# Altium schematic sheet RADG-Power-S02-V00.SchDoc: RADG Power (Filtering, Power Sequencing, USB)
size A3; DrawnBy: Jonn Dillon; DocumentNumber: 3; SheetNumber: 3; SheetTotal: 5; Version: 00; Project: QUTMS RADIO GPS; PageSetup: Record=PageOptions|CenterHorizontal=True|CenterVertical=True|PrintScale=0.97|XCorrection=1.00|YCorrection=1.00|PrintKind=0|BorderSize=5000000|LeftOffset=0|BottomOffset=0|Orientation=2|PaperLength=1000|PaperWidth=1000|Scale=100|PaperSource=7|PrintQuality=-4|MediaType=1|DitherType=10|PaperKind=A4|PrintScaleMode=1
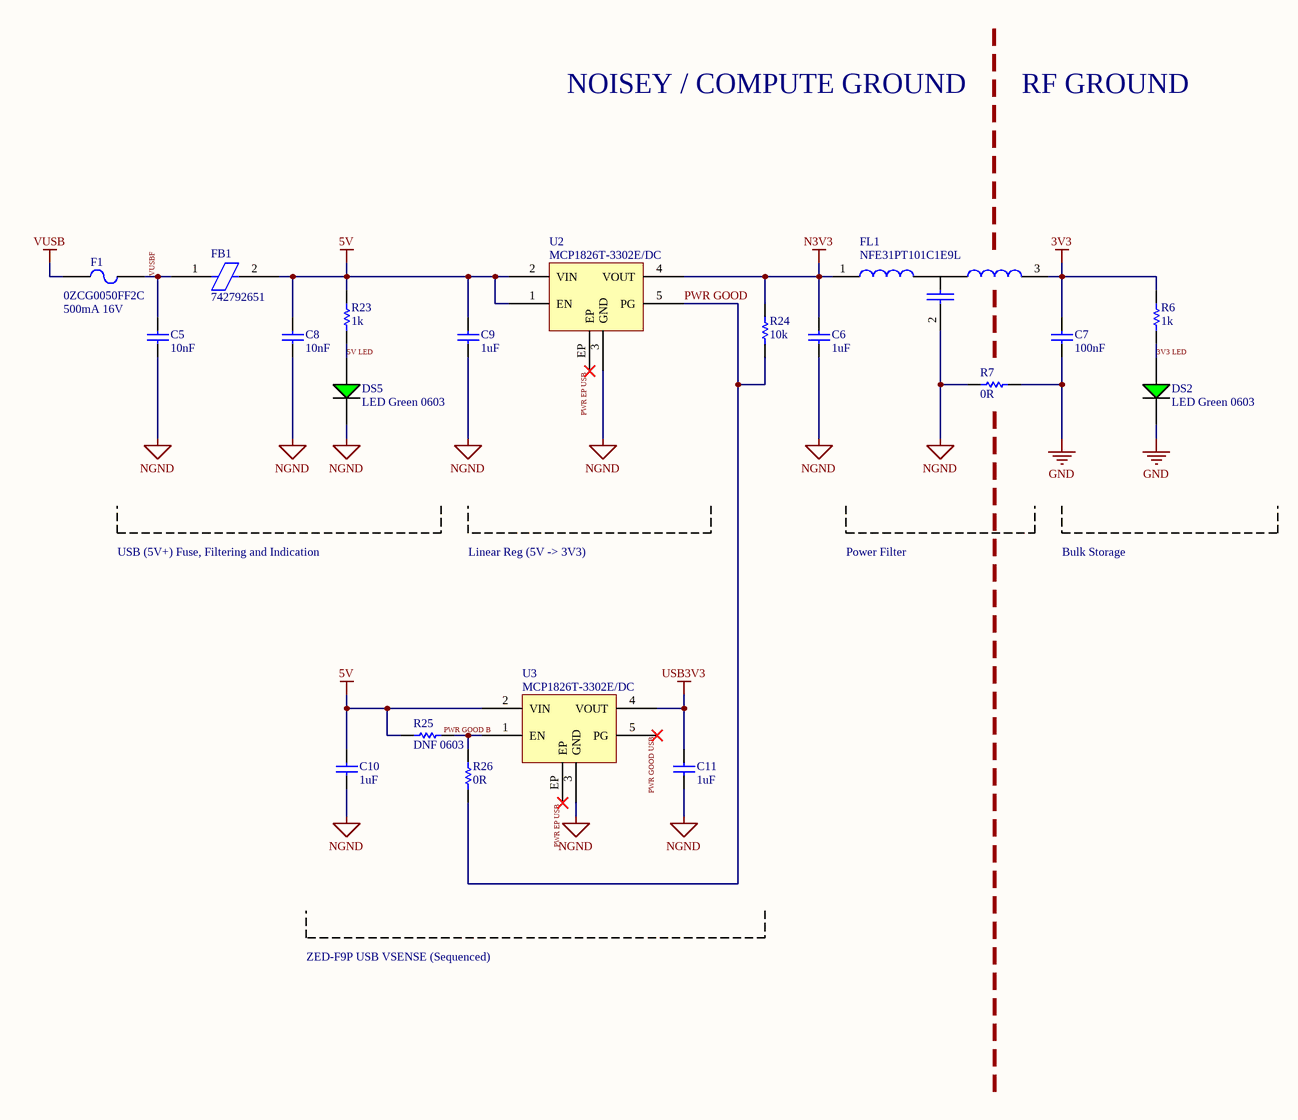
[diagram p0: RADG-Power-S02-V00.SchDoc]

## Parts
C5  10nF  [Cap_Ceramic_0603]
C6  1uF  [Cap_Ceramic_0603]
C7  100nF  [Cap_Ceramic_0603]
C8  10nF  [Cap_Ceramic_0603]
C9  1uF  [Cap_Ceramic_0603]
C10  1uF  [Cap_Ceramic_0603]
C11  1uF  [Cap_Ceramic_0603]
DS2  LED Green 0603  [LED GREEN 0603]
DS5  LED Green 0603  [LED GREEN 0603]
F1  0ZCG0050FF2C  [1812 FUSE]
FB1  742792651  [Inductor_0603]
FL1  NFE31PT101C1E9L  [NFE31PT101C1E9L]
R6  1k  [Res_ThinFilm_0603]
R7  0R  [Res_ThinFilm_0603]
R23  1k  [Res_ThinFilm_0603]
R24  10k  [Res_ThinFilm_0603]
R25  DNF 0603  [Res_ThinFilm_0603]
R26  0R  [Res_ThinFilm_0603]
U2  MCP1826T-3302E/DC  [SOT-223-5]
U3  MCP1826T-3302E/DC  [SOT-223-5]

## Nets
3V3: C7.2 FL1.3 R6.2
5V: C8.2 C9.2 C10.2 FB1.2 R23.2 R25.1 U2.1(EN) U2.2(VIN) U3.2(VIN)
GND: C7.1 DS2.2(C) R7.2
N3V3: C6.2 FL1.1 R24.2 U2.4(VOUT)
NGND: C5.1 C6.1 C8.1 C9.1 C10.1 C11.1 DS5.2(C) FL1.2 R7.1 U2.3(GND) U3.3(GND)
USB3V3: C11.2 U3.4(VOUT)
VUSB: F1.1
3V3 LED: DS2.1(A) R6.1
5V LED: DS5.1(A) R23.1
PWR EP USB: U2.EP U3.EP
PWR GOOD: R24.1 R26.1 U2.5(PG)
PWR GOOD B: R25.2 R26.2 U3.1(EN)
PWR GOOD USB: U3.5(PG)
VUSBF: C5.2 F1.2 FB1.1

## Notes on the sheet
- NOISEY / COMPUTE GROUND
- RF GROUND
- 500mA 16V
- USB (5V+) Fuse, Filtering and Indication
- Linear Reg (5V -> 3V3)
- Power Filter
- Bulk Storage
- ZED-F9P USB VSENSE (Sequenced)
- Revision History:
- Sheet Title:
- Rev
- Date
- Description
- Project:
- Size:
- Drawn By:
- A3
- Number:
- Revision:
- Sheet
- Version:
- of
- QUT Motorsport
- O-120, Gardens Point
- 2 George Street
- Brisbane, QLD 4000
- Australia
- Print Date:
- Print Time:
- File Name:

## Library data of the parts
C5 C8 = 10nF 50V 5% X7R 0603: Capacitor, Ceramic, SMD, 10nF, 50V, 5%, X7R, 0603
C6 C9-C11 = 1uF 25V 5% X7R 0603: Capacitor, Ceramic, SMD, 1uF, 25V, 5%, X7R, 0603
C7 = 100nF 50V 5% X7R 0603: Capacitor, Ceramic, SMD, 100nF, 50V, 5%, X7R, 0603
F1 = 0ZCG0050FF2C: Polymeric PTC Resettable Fuse 16V 500mA Ih Surface Mount 1812 (4532 Metric), Concave
FB1 = 742792651: 600 Ohms @ 100MHz 1 Signal Line Ferrite Bead 0603 (1608 Metric) 1A 200mOhm
FL1 = NFE31PT101C1E9L: LC (T-Type) EMI Filter 3rd Order Low Pass 1 Channel C = 100pF 6A 1206 (3216 Metric), 3 PC Pad
R6 R23 = 1k 5% 0603: Resistor, SMD, 1k, 0.1W, 5%, 0603
R7 R26 = 0R 5% 0603: Resistor, SMD, 0R, 0.1W, 5%, 0603
R24 = 10k 5% 0603: Resistor, SMD, 10k, 0.1W, 5%, 0603
R25 = DNF 0603: Resistor, SMD, DNF, 0.1W, 0603
U2 U3 = MCP1826T-3302E/DC: Linear Voltage Regulator IC Positive Fixed 1 Output 1A SOT-223-5